# Altium schematic sheet 01.STM32F103RCT6_RNF24L01.SchDoc
size A4
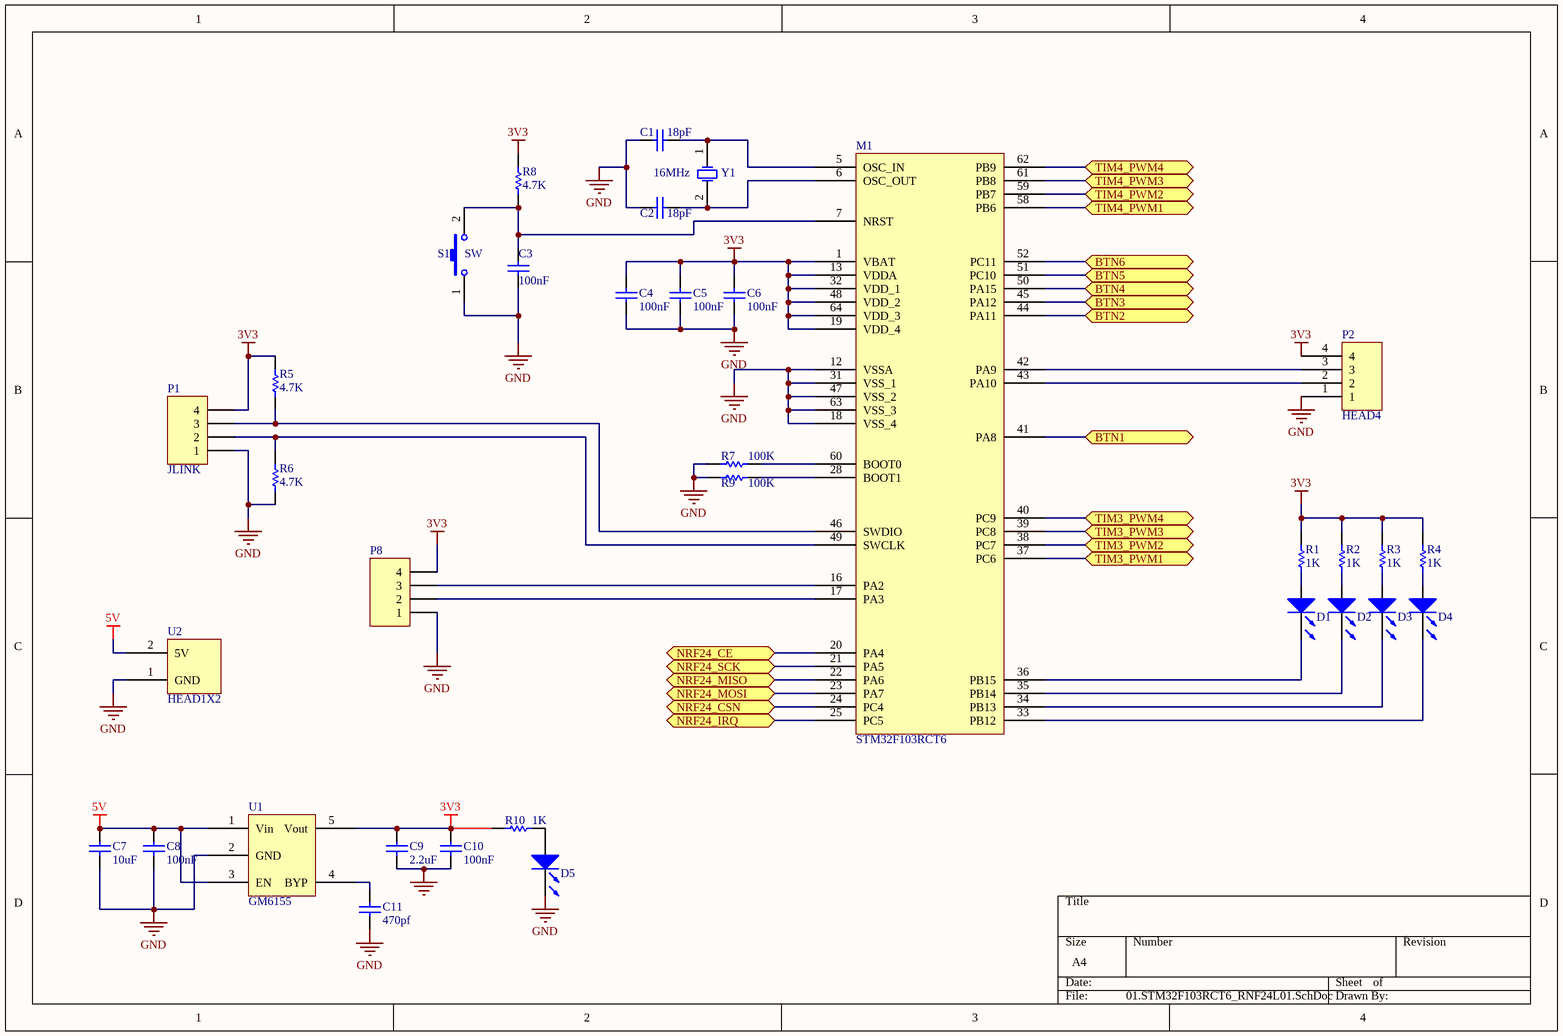
[diagram p0: 01.STM32F103RCT6_RNF24L01.SchDoc]

## Parts
C1  value 18pF  [C1206]  (hidden comment: Cap Semi)
C2  value 18pF  [C1206]  (hidden comment: Cap Semi)
C3  100nF  [0805C]
C4  100nF  [0805C]
C5  100nF  [0805C]
C6  100nF  [0805C]
C7  10uF  [0805C]
C8  100nF  [0805C]
C9  2.2uF  [0805C]
C10  100nF  [0805C]
C11  470pf  [0805C]
D1  LED  [0805_LED]  (value not drawn)
D2  LED  [0805_LED]  (value not drawn)
D3  LED  [0805_LED]  (value not drawn)
D4  LED  [0805_LED]  (value not drawn)
D5  LED  [0805_LED]  (value not drawn)
M1  STM32F103RCT6  [LQFP64]
P1  JLINK  [HDR1X4]
P2  HEAD4  [HDR1X4]
P8  USART2  [HDR1X4]  (value not drawn)
R1  1K  [0805]
R2  1K  [0805]
R3  1K  [0805]
R4  1K  [0805]
R5  4.7K  [0805]
R6  4.7K  [0805]
R7  100K  [0805]
R8  4.7K  [0805]
R9  100K  [0805]
R10  1K  [0805]
S1  SW  [SW4-6X6]
U1  GM6155  [SOT-23-5]
U2  HEAD1X2  [HDR1X2]
Y1  16MHz  [XTAL_SMD]

## Ports
BTN1, BTN2, BTN3, BTN4, BTN5, BTN6, NRF24_CE, NRF24_CSN, NRF24_IRQ, NRF24_MISO, NRF24_MOSI, NRF24_SCK, TIM3_PWM1, TIM3_PWM2, TIM3_PWM3, TIM3_PWM4, TIM4_PWM1, TIM4_PWM2, TIM4_PWM3, TIM4_PWM4

## Nets
3V3: C4.2 C5.2 C6.2 C9.1 C10.1 M1.1(VBAT) M1.13(VDDA) M1.19(VDD_4) M1.32(VDD_1) M1.48(VDD_2) M1.64(VDD_3) P1.4 P2.4 P8.4 R1.1 R2.1 R3.1 R4.1 R5.2 R8.1 R10.2 U1.5(Vout)
5V: C7.1 C8.1 U1.1(Vin) U1.3(EN) U2.2(5V)
GND: C1.1 C2.1 C3.1 C4.1 C5.1 C6.1 C7.2 C8.2 C9.2 C10.2 C11.1 D5.2(K) M1.12(VSSA) M1.18(VSS_4) M1.31(VSS_1) M1.47(VSS_2) M1.63(VSS_3) P1.1 P2.1 P8.1 R6.1 R7.1 R9.1 S1.1 U1.2(GND) U2.1(GND)
BTN1: M1.41(PA8) ; port BTN1
BTN2: M1.44(PA11) ; port BTN2
BTN3: M1.45(PA12) ; port BTN3
BTN4: M1.50(PA15) ; port BTN4
BTN5: M1.51(PC10) ; port BTN5
BTN6: M1.52(PC11) ; port BTN6
NRF24_CE: M1.20(PA4) ; port NRF24_CE
NRF24_CSN: M1.24(PC4) ; port NRF24_CSN
NRF24_IRQ: M1.25(PC5) ; port NRF24_IRQ
NRF24_MISO: M1.22(PA6) ; port NRF24_MISO
NRF24_MOSI: M1.23(PA7) ; port NRF24_MOSI
NRF24_SCK: M1.21(PA5) ; port NRF24_SCK
TIM3_PWM1: M1.37(PC6) ; port TIM3_PWM1
TIM3_PWM2: M1.38(PC7) ; port TIM3_PWM2
TIM3_PWM3: M1.39(PC8) ; port TIM3_PWM3
TIM3_PWM4: M1.40(PC9) ; port TIM3_PWM4
TIM4_PWM1: M1.58(PB6) ; port TIM4_PWM1
TIM4_PWM2: M1.59(PB7) ; port TIM4_PWM2
TIM4_PWM3: M1.61(PB8) ; port TIM4_PWM3
TIM4_PWM4: M1.62(PB9) ; port TIM4_PWM4
NetC1_2: C1.2 M1.5(OSC_IN) Y1.1(OSC1)
NetC2_2: C2.2 M1.6(OSC_OUT) Y1.2(OSC2)
NetC3_2: C3.2 M1.7(NRST) R8.2 S1.2
NetC11_2: C11.2 U1.4(BYP)
NetD1_1: D1.1(A) R1.2
NetD1_2: D1.2(K) M1.36(PB15)
NetD2_1: D2.1(A) R2.2
NetD2_2: D2.2(K) M1.35(PB14)
NetD3_1: D3.1(A) R3.2
NetD3_2: D3.2(K) M1.34(PB13)
NetD4_1: D4.1(A) R4.2
NetD4_2: D4.2(K) M1.33(PB12)
NetD5_1: D5.1(A) R10.1
NetM1_16: M1.16(PA2) P8.3
NetM1_17: M1.17(PA3) P8.2
NetM1_28: M1.28(BOOT1) R9.2
NetM1_42: M1.42(PA9) P2.3
NetM1_43: M1.43(PA10) P2.2
NetM1_46: M1.46(SWDIO) P1.3 R5.1
NetM1_49: M1.49(SWCLK) P1.2 R6.2
NetM1_60: M1.60(BOOT0) R7.2

## Library data of the parts
C1 C2 = Cap Semi: Capacitor (Semiconductor SIM Model); Published: 8-Jun-2000; LatestRevisionDate: 29-May-2009; LatestRevisionNote: IPC-7351 Footprint Added.; PackageReference: C1206; Publisher: Altium Limited; PackageDescription: Chip Capacitor
C3-C11 = Cap: Capacitor; Published: 8-Jun-2000; LatestRevisionDate: 17-Jul-2002; LatestRevisionNote: Re-released for DXP Platform.; PackageReference: RAD-0.3; Publisher: Altium Limited
D1-D5 = LED: Typical RED GaAs LED; Published: 8-Jun-2000; LatestRevisionDate: 08-Jul-2005; LatestRevisionNote: Mech Layer 1 removed.; PackageReference: LED-1; Publisher: Altium Limited; PackageDescription: 100mil.
P1 P8 = Header 4: Header, 4-Pin; LatestRevisionDate: 17-Jul-2002; LatestRevisionNote: Re-released for DXP Platform.; Publisher: Altium Limited
R1-R10 = Res Semi: Semiconductor Resistor; Published: 8-Jun-2000; LatestRevisionDate: 17-Jul-2002; LatestRevisionNote: Re-released for DXP Platform.; PackageReference: AXIAL-0.5; Publisher: Altium Limited; PackageDescription: Axial Device, Thru-Hole; 2 Leads; 0.5 in Pin Spacing
S1 = SW: Switch; Published: 24-Mar-1999; LatestRevisionDate: 17-Jul-2002; LatestRevisionNote: Re-released for DXP Platform.; PackageReference: SPST-2; Publisher: Altium Limited
Y1 = XTAL: Crystal Oscillator; Published: 8-Jun-2000; LatestRevisionDate: 17-Jul-2002; LatestRevisionNote: Re-released for DXP Platform.; PackageReference: R38; Publisher: Altium Limited